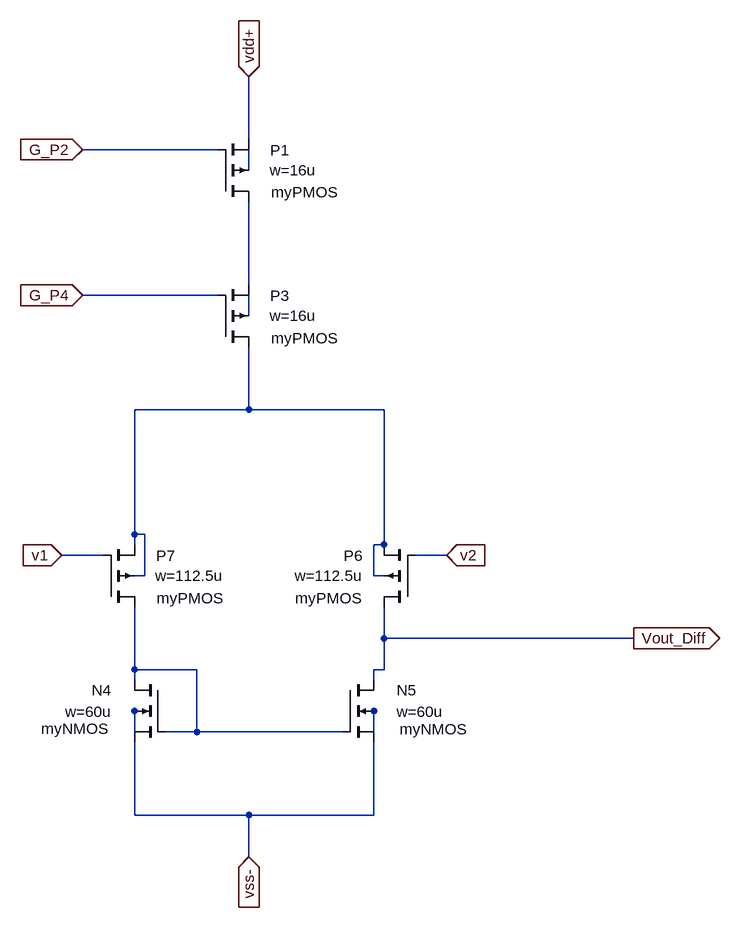
[diagram p0: schematic Differential_Amplifier.asc]
Differential_Amplifier.asc, the LTspice schematic file:
Version 4
SHEET 1 880 684
WIRE 112 -528 112 -624
WIRE 64 -512 -144 -512
WIRE 112 -480 112 -512
WIRE 112 -304 112 -432
WIRE 64 -288 -144 -288
WIRE 112 -256 112 -288
WIRE 112 -112 112 -208
WIRE 112 -112 -64 -112
WIRE 320 -112 112 -112
WIRE -64 80 -64 -112
WIRE -48 80 -64 80
WIRE -64 96 -64 80
WIRE 320 96 320 -112
WIRE 320 96 304 96
WIRE -112 112 -176 112
WIRE 416 112 368 112
WIRE -48 144 -48 80
WIRE -48 144 -64 144
WIRE 304 144 304 96
WIRE 320 144 304 144
WIRE 320 240 320 192
WIRE 704 240 320 240
WIRE -64 288 -64 192
WIRE 32 288 -64 288
WIRE 320 288 320 240
WIRE 320 288 304 288
WIRE -64 304 -64 288
WIRE 304 304 304 288
WIRE -48 352 -64 352
WIRE 304 352 288 352
WIRE -64 384 -64 352
WIRE 32 384 32 288
WIRE 32 384 -16 384
WIRE 256 384 32 384
WIRE 304 384 304 352
WIRE -64 512 -64 400
WIRE 112 512 -64 512
WIRE 304 512 304 400
WIRE 304 512 112 512
WIRE 112 576 112 512
FLAG -176 112 v1
IOPIN -176 112 In
FLAG 416 112 v2
IOPIN 416 112 In
FLAG 112 -624 vdd+
IOPIN 112 -624 In
FLAG 112 576 vss-
IOPIN 112 576 In
FLAG 704 240 Vout_Diff
IOPIN 704 240 Out
FLAG -144 -512 G_P2
IOPIN -144 -512 In
FLAG -144 -288 G_P4
IOPIN -144 -288 In
SYMBOL pmos4 64 -432 M180
WINDOW 3 82 14 Left 2
WINDOW 0 81 79 Left 2
WINDOW 123 80 48 Left 2
SYMATTR Value myPMOS
SYMATTR InstName P1
SYMATTR Value2 w=16u
SYMBOL pmos4 64 -208 M180
WINDOW 3 82 14 Left 2
WINDOW 0 81 79 Left 2
WINDOW 123 80 48 Left 2
SYMATTR Value myPMOS
SYMATTR InstName P3
SYMATTR Value2 w=16u
SYMBOL nmos4 -16 304 M0
WINDOW 3 87 75 Left 2
WINDOW 0 83 16 Left 2
WINDOW 123 83 49 Left 2
SYMATTR Value myNMOS
SYMATTR InstName N4
SYMATTR Value2 w=60u
SYMBOL nmos4 256 304 R0
WINDOW 3 88 76 Left 2
WINDOW 0 83 16 Left 2
WINDOW 123 83 49 Left 2
SYMATTR Value myNMOS
SYMATTR InstName N5
SYMATTR Value2 w=60u
SYMBOL pmos4 368 192 R180
WINDOW 3 82 14 Left 2
WINDOW 0 81 79 Left 2
WINDOW 123 80 48 Left 2
SYMATTR Value myPMOS
SYMATTR InstName P6
SYMATTR Value2 w=112.5u
SYMBOL pmos4 -112 192 M180
WINDOW 3 82 14 Left 2
WINDOW 0 81 79 Left 2
WINDOW 123 80 48 Left 2
SYMATTR Value myPMOS
SYMATTR InstName P7
SYMATTR Value2 w=112.5u

The netlist it stands for:
* Differential_Amplifier.asc
M§P1 N002 G_P2 vdd+ N001 myPMOS w=16u
M§P3 N004 G_P4 N002 N003 myPMOS w=16u
M§N4 N005 N005 vss- N006 myNMOS w=60u
M§N5 Vout_Diff N005 vss- N007 myNMOS w=60u
M§P6 Vout_Diff v2 N004 N004 myPMOS w=112.5u
M§P7 N005 v1 N004 N004 myPMOS w=112.5u
.model NMOS NMOS
.model PMOS PMOS
.lib standard.mos
.backanno
.end